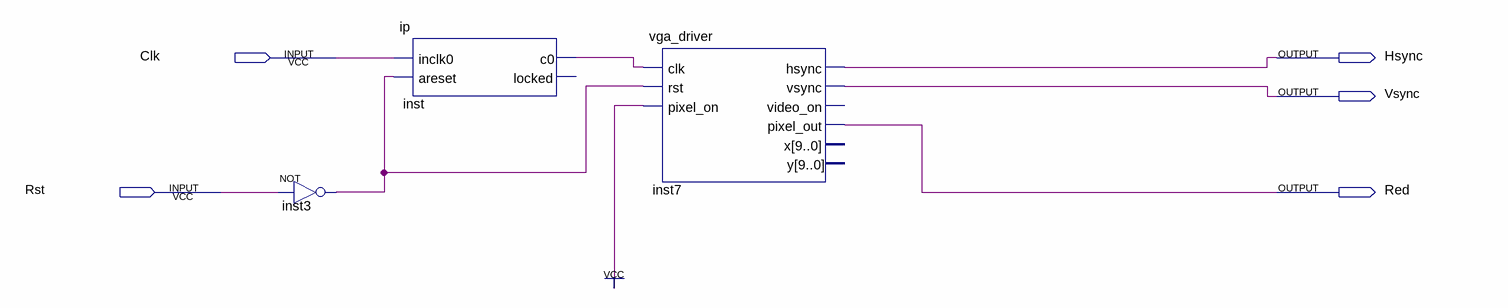
[diagram p0: schematic sheet]
// Quartus schematic Block1.bdf as structural Verilog: 3 symbols, 5 pins
module Block1 (
  input  Clk,
  input  Rst,
  output Hsync,
  output Vsync,
  output Red
);

  wire inst3_out, inst_c0;

  not inst3 (inst3_out, Rst);
  ip inst (.areset(inst3_out), .inclk0(Clk), .c0(inst_c0));  // open: locked
  vga_driver inst7 (
    .clk(inst_c0), .rst(inst3_out), .pixel_on(1'b1), .hsync(Hsync), .vsync(Vsync), .pixel_out(Red));  // open: video_on, x, y
endmodule
